# EAGLE schematic SFX100_LeonardoBreakout (EAGLE 9.3.1)
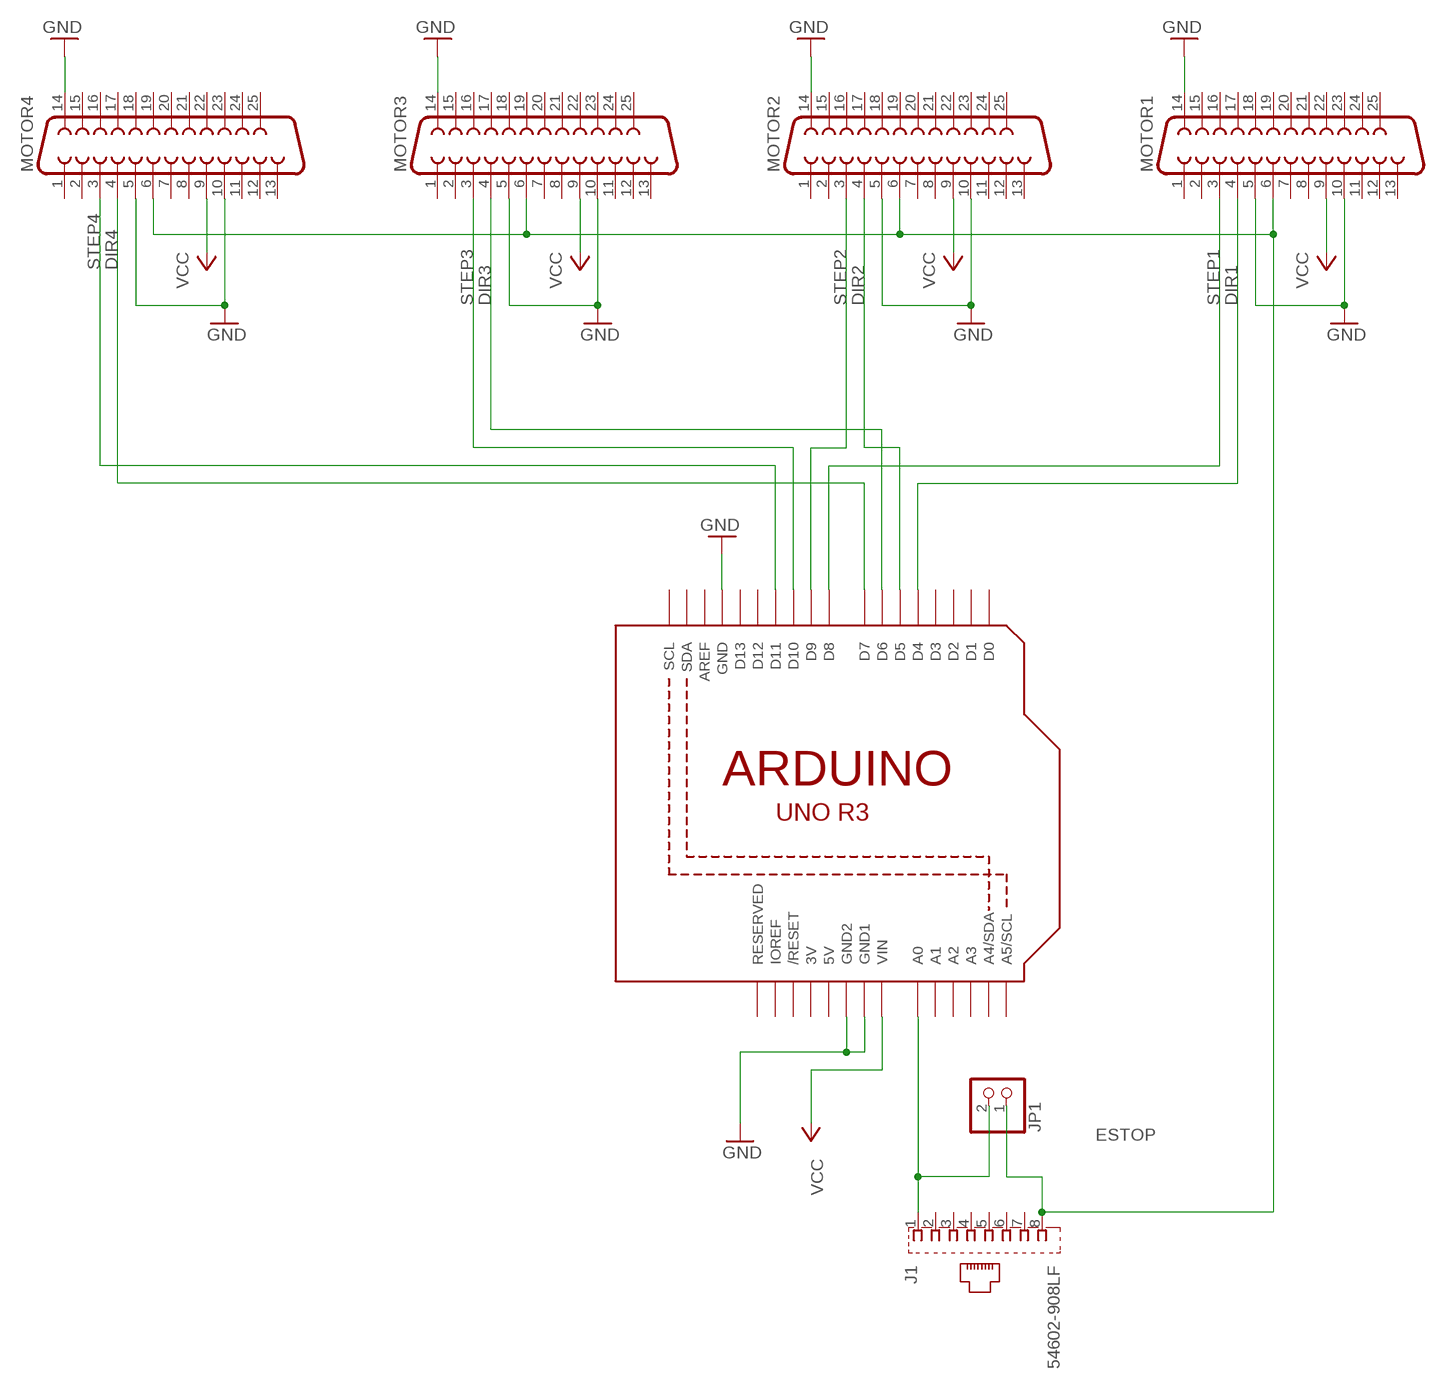
[diagram p0: schematic, sheet 1]

## Parts
J1  54602-908LF  [AMPHENOL_54602-908LF]
JP1  PINHD-1X2  [1X02]
MOTOR1  F25V  [F25V]
MOTOR2  F25V  [F25V]
MOTOR3  F25V  [F25V]
MOTOR4  F25V  [F25V]
U1  ARDUINOR3-BPLACE  [ARDUINOR3-BPLACE]

## Nets
DIR1: MOTOR1.4 U1.D4
DIR2: MOTOR2.4 U1.D5
DIR3: MOTOR3.4 U1.D6
DIR4: MOTOR4.4 U1.D7
ENA: J1.1 JP1.2 U1.A0
ESTOP: J1.8 JP1.1 MOTOR1.6 MOTOR2.6 MOTOR3.6 MOTOR4.6
GND: MOTOR1.5 MOTOR1.10 MOTOR1.14 MOTOR2.5 MOTOR2.10 MOTOR2.14 MOTOR3.5 MOTOR3.10 MOTOR3.14 MOTOR4.5 MOTOR4.10 MOTOR4.14 U1.GND U1.GND1 U1.GND2
STEP1: MOTOR1.3 U1.D8
STEP2: MOTOR2.3 U1.D9
STEP3: MOTOR3.3 U1.D10
STEP4: MOTOR4.3 U1.D11
VCC: MOTOR1.9 MOTOR2.9 MOTOR3.9 MOTOR4.9 U1.VIN
Unconnected: J1.2 J1.3 J1.4 J1.5 J1.6 J1.7 MOTOR1.1 MOTOR1.2 MOTOR1.7 MOTOR1.8 MOTOR1.11 MOTOR1.12 MOTOR1.13 MOTOR1.15 MOTOR1.16 MOTOR1.17 MOTOR1.18 MOTOR1.19 MOTOR1.20 MOTOR1.21 MOTOR1.22 MOTOR1.23 MOTOR1.24 MOTOR1.25 MOTOR2.1 MOTOR2.2 MOTOR2.7 MOTOR2.8 MOTOR2.11 MOTOR2.12 MOTOR2.13 MOTOR2.15 MOTOR2.16 MOTOR2.17 MOTOR2.18 MOTOR2.19 MOTOR2.20 MOTOR2.21 MOTOR2.22 MOTOR2.23 MOTOR2.24 MOTOR2.25 MOTOR3.1 MOTOR3.2 MOTOR3.7 MOTOR3.8 MOTOR3.11 MOTOR3.12 MOTOR3.13 MOTOR3.15 MOTOR3.16 MOTOR3.17 MOTOR3.18 MOTOR3.19 MOTOR3.20 MOTOR3.21 MOTOR3.22 MOTOR3.23 MOTOR3.24 MOTOR3.25 MOTOR4.1 MOTOR4.2 MOTOR4.7 MOTOR4.8 MOTOR4.11 MOTOR4.12 MOTOR4.13 MOTOR4.15 MOTOR4.16 MOTOR4.17 MOTOR4.18 MOTOR4.19 MOTOR4.20 MOTOR4.21 MOTOR4.22 MOTOR4.23 MOTOR4.24 MOTOR4.25 U1.A1 U1.A2 U1.A3 U1.A4(A4/SDA) U1.A5(A5/SCL) U1.AREF U1.D0 U1.D1 U1.D2 U1.D3 U1.D12 U1.D13 U1.IOREF U1.RESERVED U1.RESET(/RESET) U1.SCL U1.SDA

## Power pins joined to a net without a drawn wire
3V: U1.3V
5V: U1.5V

## Library data of the parts
J1 = 54602-908LF:54602-908LF: CONN MOD JACK 8P8C R/A UNSHLD; DESCRIPTION: Cat3 Rj45 Modular Jack, 8 Position, 1 Port; DIGI-KEY_PART_NUMBER: 609-1046-ND; DIGI-KEY_PURCHASE_URL: https://www.digikey.com/product-detail/en/amphenol-icc-fci/54602-908LF/609-1046-ND/1001360?utm_source=snapeda&utm_medium=aggregator&utm_campaign=symbol; MF: Amphenol ICC; MP: 54602-908LF; PACKAGE: None
JP1 = pinhead:PINHD-1X2: PIN HEADER
MOTOR1-MOTOR4 = con-subd:F25: SUB-D; OC_FARNELL: unknown; OC_NEWARK: unknown
U1 = adafruit:ARDUINOR3: This is a new object for the new Arduino R3 - with extra pins that you may want to use (such as IOref, and duplicated A4/A5